# Altium schematic sheet 1_Power.SchDoc
size A4; SheetNumber: 1; SheetTotal: 4
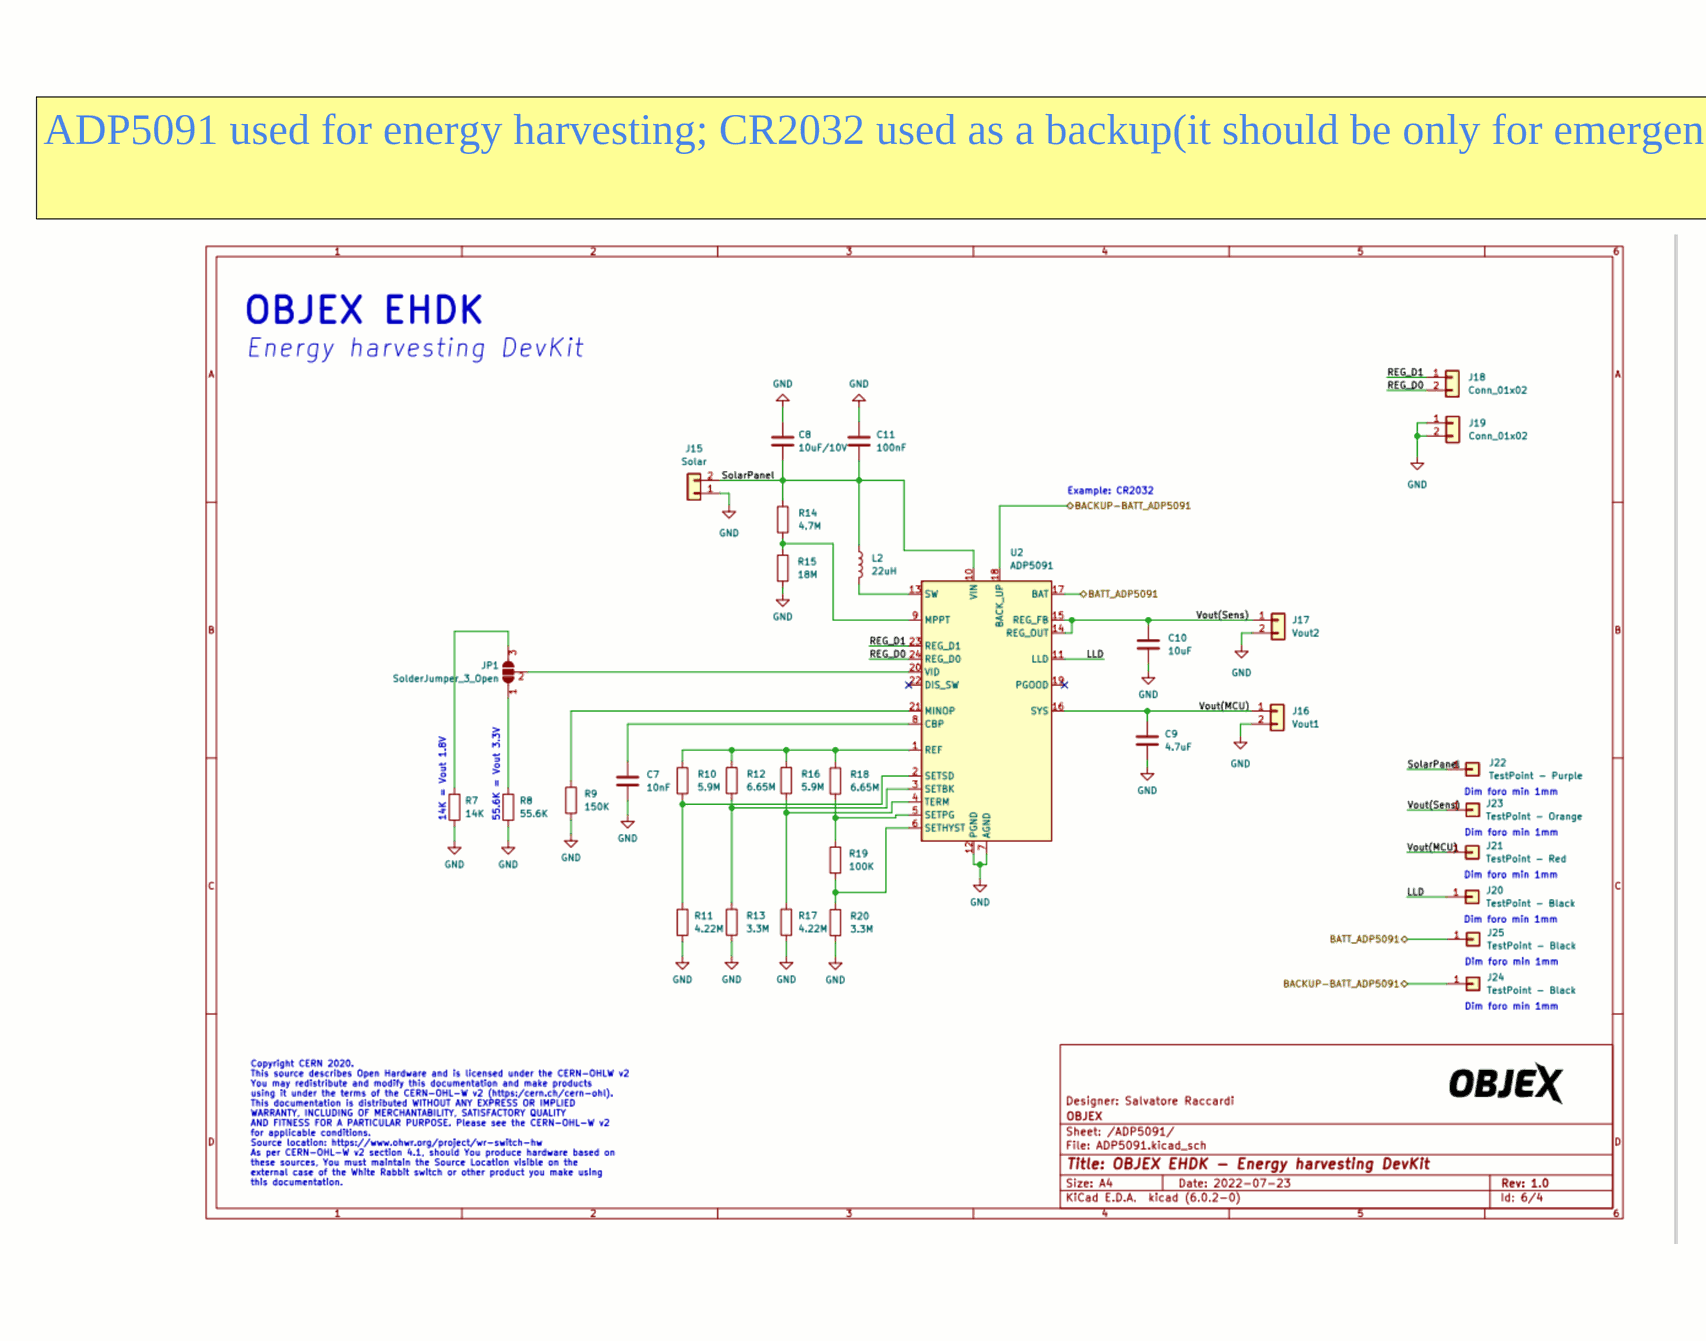
[diagram p0: 1_Power.SchDoc, left]
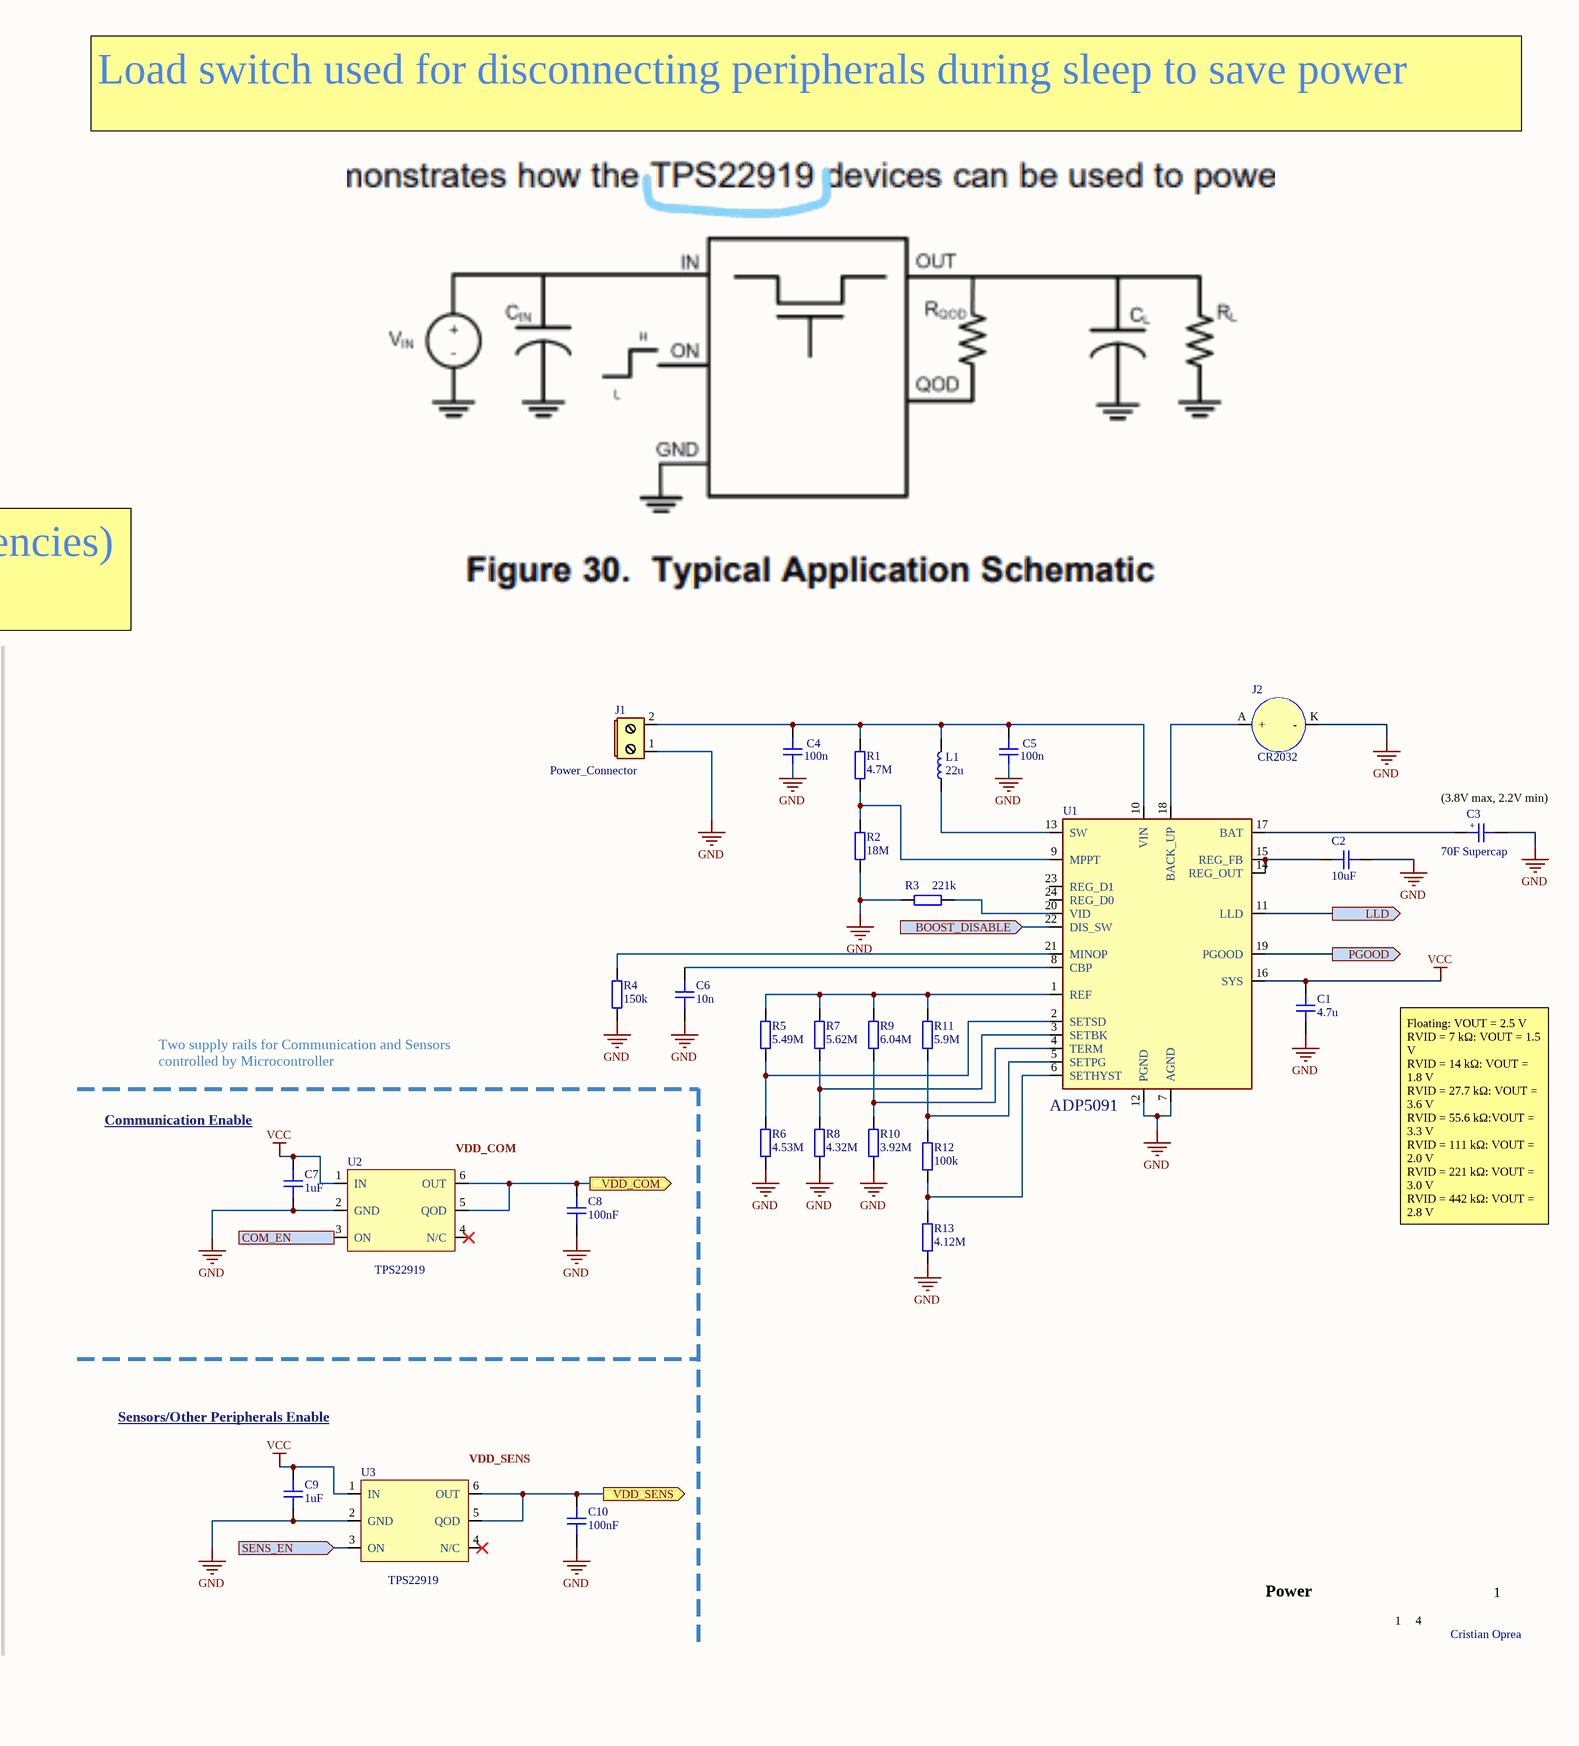
[diagram p1: 1_Power.SchDoc, middle]
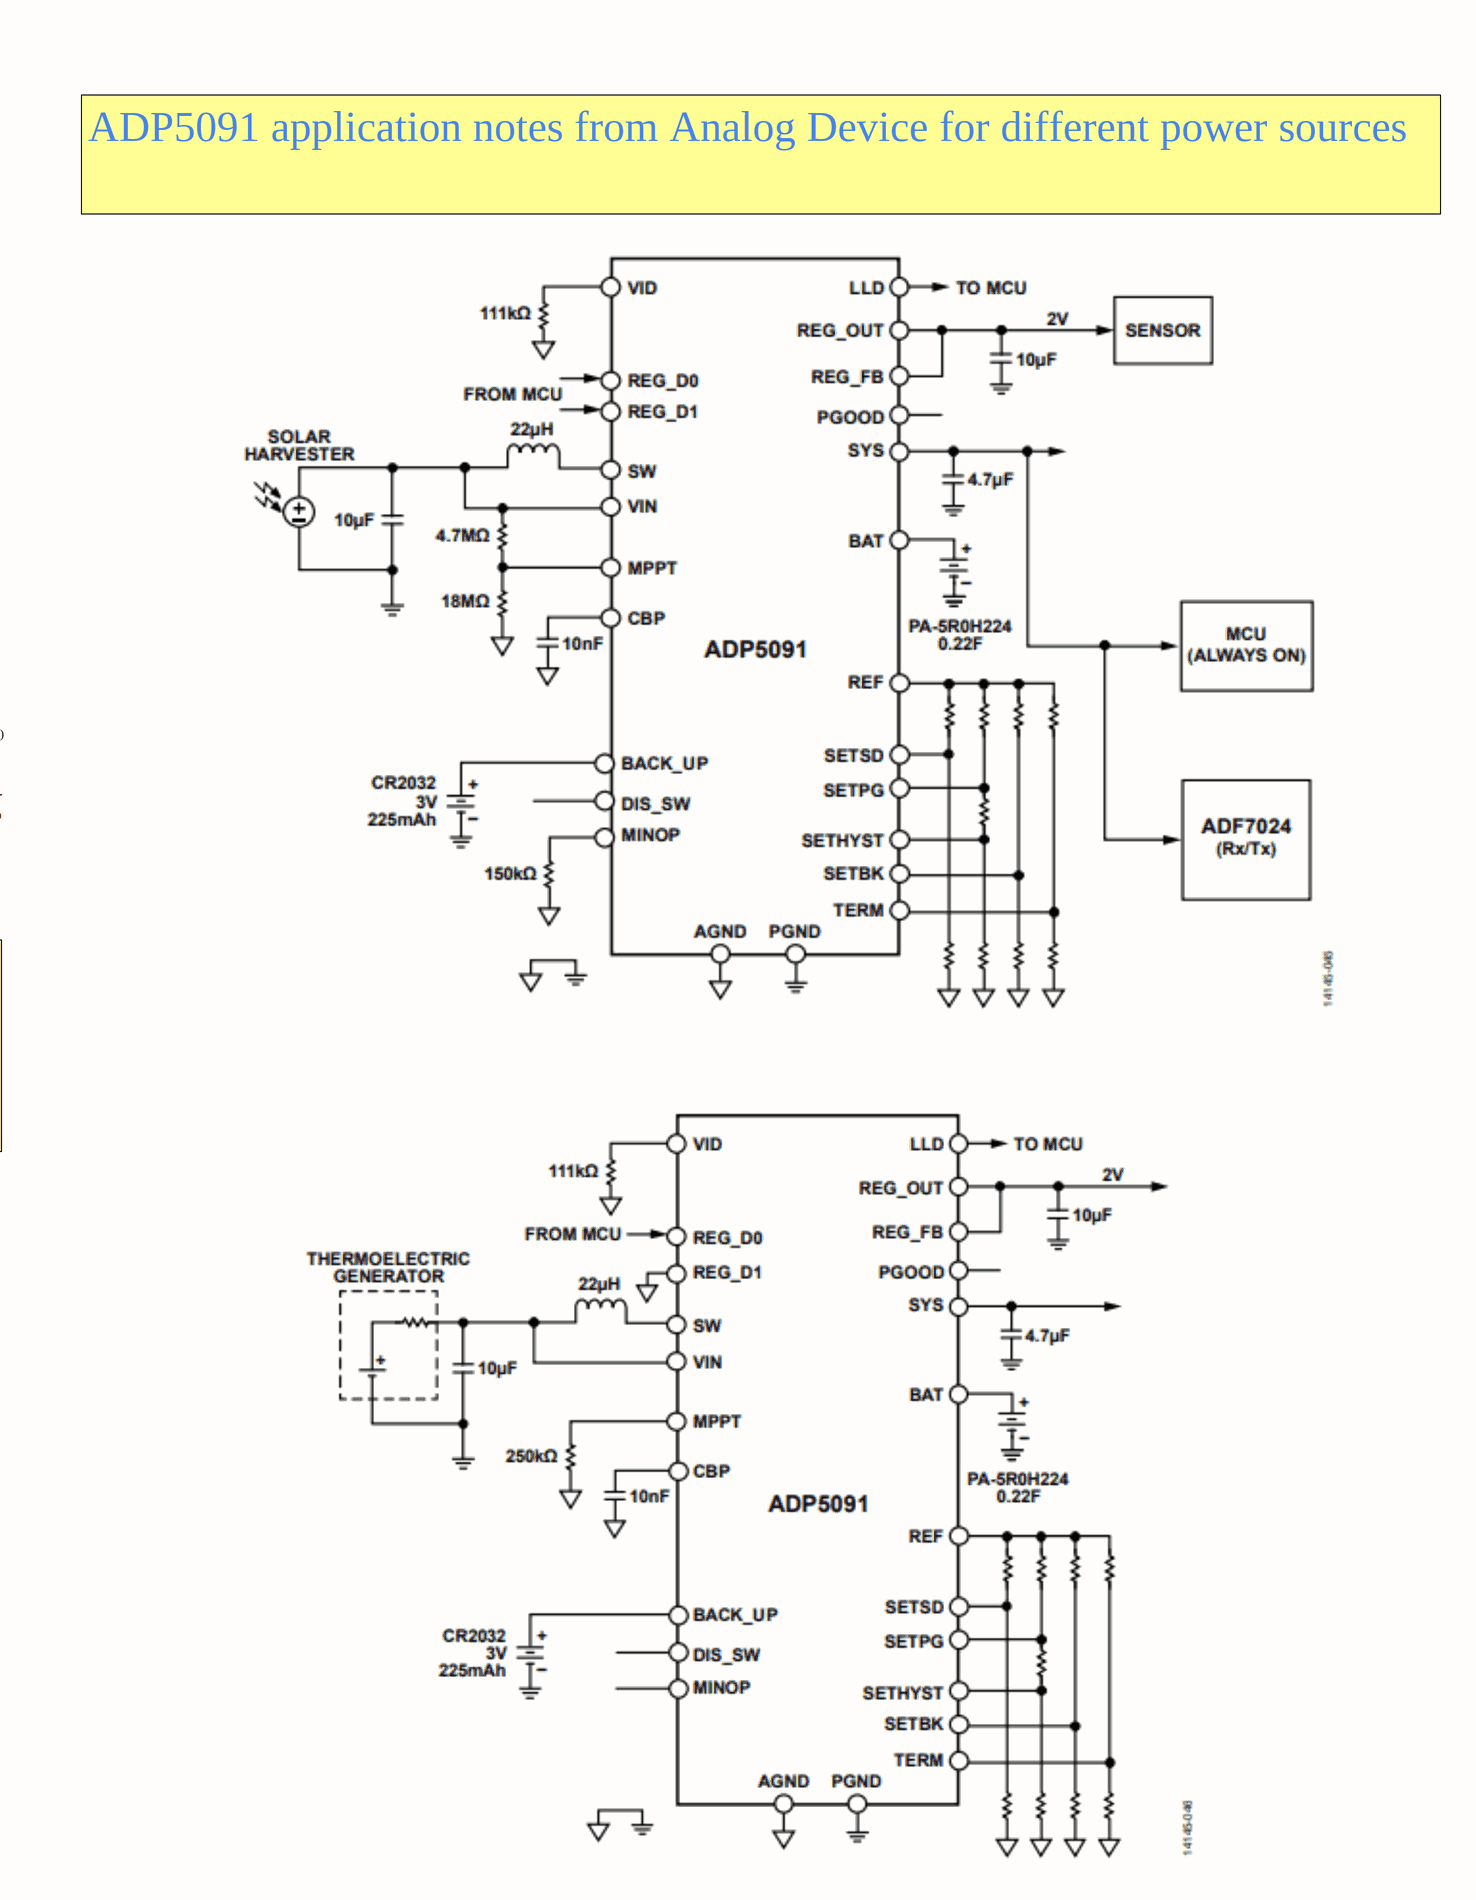
[diagram p2: 1_Power.SchDoc, right]

## Parts
C1  4.7u  [CAP_0603]
C2  10uF  [CAP_0603]
C3  70F Supercap  [CAP_TANT_0603]
C4  100n  [CAP_0603]
C5  100n  [CAP_0603]
C6  10n  [CAP_0603]
C7  1uF  [CAP_0603]
C8  100nF  [CAP_0603]
C9  1uF  [CAP_0603]
C10  100nF  [CAP_0603]
J1  Power_Connector
J2  CR2032  [CR2032]
L1  22u  [IND_1008]
R1  4.7M  [RES_0603]
R2  18M  [RES_0603]
R3  221k  [RES_0603]
R4  150k  [RES_0603]
R5  5.49M  [RES_0603]
R6  4.53M  [RES_0603]
R7  5.62M  [RES_0603]
R8  4.32M  [RES_0603]
R9  6.04M  [RES_0603]
R10  3.92M  [RES_0603]
R11  5.9M  [RES_0603]
R12  100k  [RES_0603]
R13  4.12M  [RES_0603]
U1  ADP5091
U2  TPS22919
U3  TPS22919

## Ports
BOOST_DISABLE (in), COM_EN (in), LLD (out), PGOOD (out), SENS_EN (in), VDD_COM (out), VDD_SENS (out)

## Nets
GND: C1.1 C2.2 C3.K C4.1 C5.1 C6.1 C7.1 C8.1 C9.1 C10.1 J1.1 J2.K(-) R2.1 R3.1 R4.1 R6.1 R8.1 R10.1 R13.1 U1.7(AGND) U1.12(PGND) U2.2(GND) U3.2(GND)
VCC: C1.2 C7.2 C9.2 U1.16(SYS) U2.1(IN) U3.1(IN)
BOOST_DISABLE: U1.22(DIS_SW) ; port BOOST_DISABLE
COM_EN: U2.3(ON) ; port COM_EN
LLD: U1.11(LLD) ; port LLD
PGOOD: U1.19(PGOOD) ; port PGOOD
SENS_EN: U3.3(ON) ; port SENS_EN
VDD_COM: C8.2 U2.5(QOD) U2.6(OUT) ; port VDD_COM
VDD_SENS: C10.2 U3.5(QOD) U3.6(OUT) ; port VDD_SENS
NetC2_1: C2.1 U1.14(REG_OUT) U1.15(REG_FB)
NetC3_A: C3.A U1.17(BAT)
NetC4_2: C4.2 C5.2 J1.2 L1.2 R1.2 U1.10(VIN)
NetC6_2: C6.2 U1.8(CBP)
NetJ2_A: J2.A(+) U1.18(BACK_UP)
NetL1_1: L1.1 U1.13(SW)
NetR1_1: R1.1 R2.2 U1.9(MPPT)
NetR3_2: R3.2 U1.20(VID)
NetR4_2: R4.2 U1.21(MINOP)
NetR5_1: R5.1 R6.2 U1.2(SETSD)
NetR5_2: R5.2 R7.2 R9.2 R11.2 U1.1(REF)
NetR7_1: R7.1 R8.2 U1.3(SETBK)
NetR9_1: R9.1 R10.2 U1.4(TERM)
NetR11_1: R11.1 R12.2 U1.5(SETPG)
NetR12_1: R12.1 R13.2 U1.6(SETHYST)

Not connected (* = marked no-connect by the designer): U1 23(REG_D1) 24(REG_D0); U2 4(N/C)*; U3 4(N/C)*

## Notes on the sheet
- Load switch used for disconnecting peripherals during sleep to save power
- ADP5091 application notes from Analog Device for different power sources
- ADP5091 used for energy harvesting; CR2032 used as a backup(it should be only for emergencies)
- R1 not populated for TEG generators
- (near C3) (3.8V max, 2.2V min)
- VID resistor for setting output voltage
- Low Light Density (low voltage at input), PGOOD is HIGH only when output voltage is higher than the set voltage
- Two supply rails for Communication and Sensors controlled by Microcontroller
- Communication Enable
- (near U2) VDD_COM
- Vsetsd = 2.2V (stop discharge threshold) (hybrid supercapacitor with lithium)
- Vsetbk = 2.3V (backup supply swith on threshold)(higher than stop discharge threshold)
- (near R12) Vbat_term = 3.8V (stop charge threshold) (hybrid supercapacitor with lithium)
- (near R12) Vsetbkhys = (hysteresis threshold)
- Floating: VOUT = 2.5 V
  RVID = 7 kΩ: VOUT = 1.5 V
  RVID = 14 kΩ: VOUT = 1.8 V
  RVID = 27.7 kΩ: VOUT = 3.6 V
  RVID = 55.6 kΩ:VOUT = 3.3 V
  RVID = 111 kΩ: VOUT = 2.0 V
  RVID = 221 kΩ: VOUT = 3.0 V
  RVID = 442 kΩ: VOUT = 2.8 V
- (near R13) Vsetpg = 2.4V (power good threshold) (voltage output is higher than this threshold)
- Sensors/Other Peripherals Enable
- (near U3) VDD_SENS
- Power
- 1
- 4
- Cristian Oprea
- (in symbol Supercapacitor) +

## Library data of the parts
C1 C2 C4-C10 = CAP_0603: Capacitor SMD 0603; Manufacturer: *; Manufacturer Part Number: *; Distributor Link: *; LCSC: *; Rating: *; Dielectric: *
C3 = Supercapacitor: Manufacturer: *; Manufacturer Part Number: *; Distributor Link: *; LCSC: *
J1 = Power_Connector: Screw terminal or plug terminal for power
J2 = CR2032-BS-6-1: CR2032 Coin Cell Battery Holder; Manufacturer: Q&J; Manufacturer Part Number: CR2032-BS-6-1
L1 = IND_1008: Inductor SMD 1008
R1-R13 = RES_0603: Resistor SMD 0603; Manufacturer: *; Manufacturer Part Number: *; Distributor Link: *; LCSC: *
U1 = ADP5091: Ultralow Power Energy Harvester PMUs / with MPPT and Charge Management and BAckup Supply
U2 U3 = TPS22919: 5.5-V, 1.5-A, 90-mΩ load switch with adjustable output discharge